# EAGLE design new_york_rev_A (EAGLE 5.11)
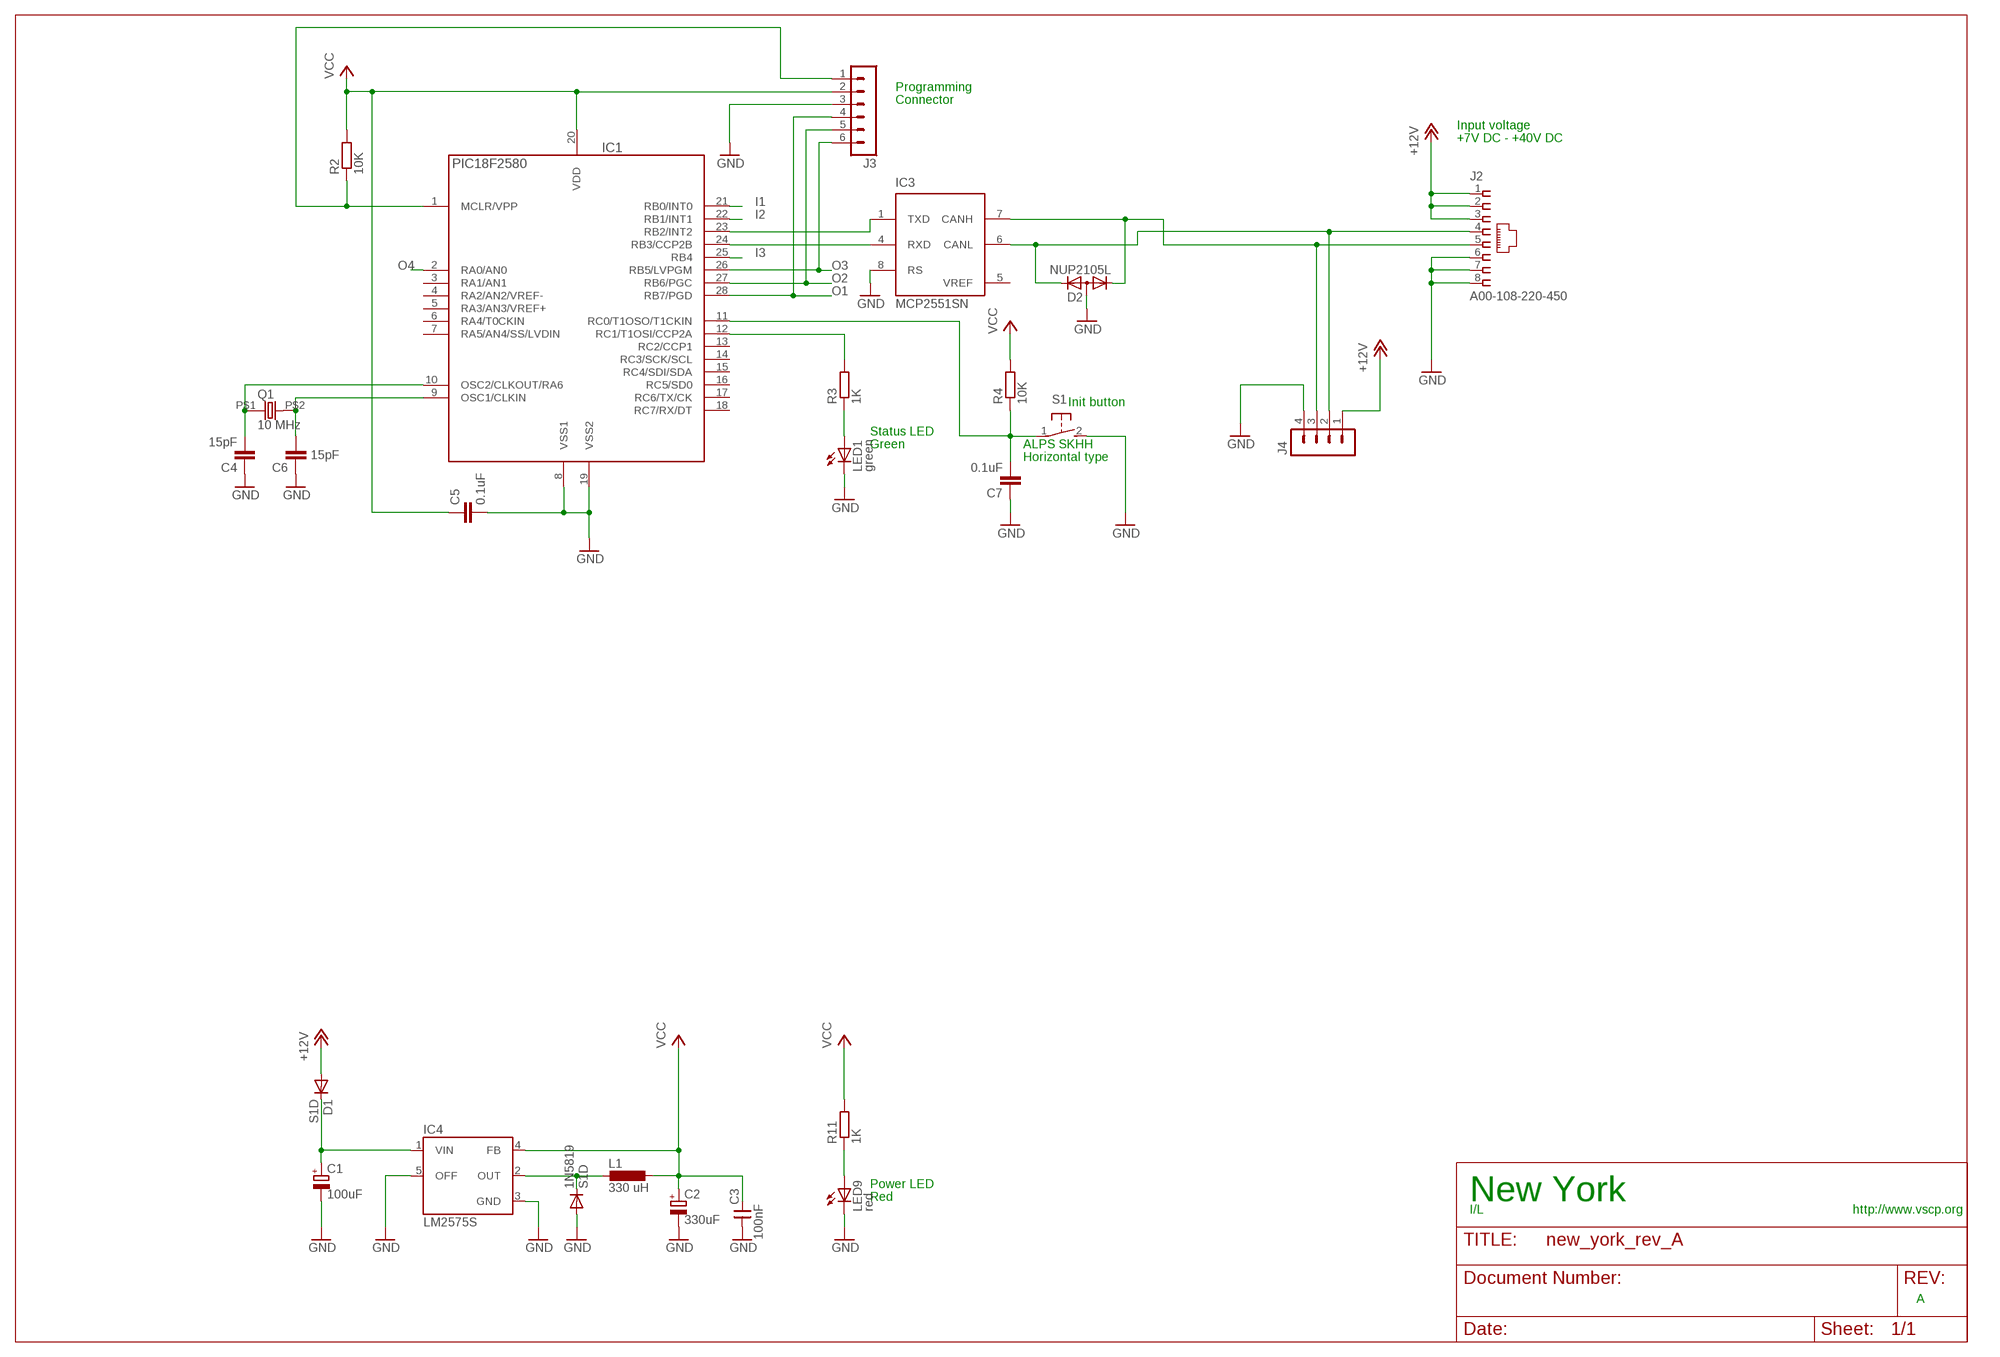
[diagram p0: schematic, sheet 1]

## Parts
1N5819  S1D  DIODE-SMB  [SMB]
C1  100uF  CPOL-EUD  [PANASONIC_D]
C2  330uF  CPOL-EUD  [PANASONIC_D]
C3  100nF  CNP-0805  [0805]
C4  15pF  C-EUC0805  [C0805]
C5  0.1uF  C-EUC0805  [C0805]
C6  15pF  C-EUC0805  [C0805]
C7  0.1uF  C-EUC0805  [C0805]
D1  S1D  DIODE-SMB  [SMB]
D2  NUP2105L  DIODE-2CA|ACSOT23  [SOT23]
IC1  PIC18F2580  PIC18LF252-I/SO  [SO28]
IC3  MCP2551SN  [SO-08]
IC4  LM2575S  [TO263-5]
J2  A00-108-220-450  [RJ-45]
J3  MA06-1  [MA06-1]
J4  MA04-1  [MA04-1]
L1  330 uH  DO3316P  [DO3316P]
LED1  green  LEDCHIP-LED0805  [CHIP-LED0805]
LED9  red  LEDCHIP-LED0805  [CHIP-LED0805]
Q1  10 MHz  HC-49S  [9C]
R2  10K  R-EU_R0805  [R0805]
R3  1K  R-EU_R0805  [R0805]
R4  10K  R-EU_R0805  [R0805]
R11  1K  R-EU_R0805  [R0805]
S1  31-XX  [B3F-31XX]

## Nets
+12V: D1.A J2.1 J2.2 J2.3 J4.1
CANH: D2.1(K1) IC3.7(CANH) J2.5 J4.3
CANL: D2.2(K2) IC3.6(CANL) J2.4 J4.2
GND: 1N5819.A C1.- C2.- C3.1 C4.1 C5.2 C6.1 C7.1 D2.3(A) IC1.8(VSS1) IC1.19(VSS2) IC3.8(RS) IC4.3(GND) IC4.5(OFF) J2.6 J2.7 J2.8 J3.3 J4.4 LED1.C LED9.C S1.2(S)
I1: IC1.21(RB0/INT0)
I2: IC1.22(RB1/INT1)
I3: IC1.25(RB4)
N$1: 1N5819.C IC4.2(OUT) L1.1
N$2: C4.2 IC1.10(OSC2/CLKOUT/RA6) Q1.P$1
N$3: C1.+ D1.C IC4.1(VIN)
N$4: IC1.12(RC1/T1OSI/CCP2A) R3.2
N$5: LED1.A R3.1
N$6: C7.2 IC1.11(RC0/T1OSO/T1CKIN) R4.1 S1.1(P)
N$7: C6.2 IC1.9(OSC1/CLKIN) Q1.P$2
N$12: IC1.1(MCLR/VPP) J3.1 R2.1
N$20: LED9.A R11.1
O1: IC1.28(RB7/PGD) J3.4
O2: IC1.27(RB6/PGC) J3.5
O3: IC1.26(RB5/LVPGM) J3.6
O4: IC1.2(RA0/AN0)
RXCAN: IC1.24(RB3/CCP2B) IC3.4(RXD)
TXCAN: IC1.23(RB2/INT2) IC3.1(TXD)
VCC: C2.+ C3.2 C5.1 IC1.20(VDD) IC4.4(FB) J3.2 L1.2 R2.2 R4.2 R11.2
Unconnected: IC1.3(RA1/AN1) IC1.4(RA2/AN2/VREF-) IC1.5(RA3/AN3/VREF+) IC1.6(RA4/T0CKIN) IC1.7(RA5/AN4/SS/LVDIN) IC1.13(RC2/CCP1) IC1.14(RC3/SCK/SCL) IC1.15(RC4/SDI/SDA) IC1.16(RC5/SD0) IC1.17(RC6/TX/CK) IC1.18(RC7/RX/DT)

## Notes on the sheet
- Programming
- Connector
- Input voltage
- +7V DC - +40V DC
- Init button
- Status LED
- Green | ALPS SKHH
- Horizontal type
- Power LED
- Red | New York
- I/L | http://www.vscp.org
- A

## Power pins joined to a net without a drawn wire
GND: IC3.2(VSS)
VCC: IC3.3(VDD)
VREF: IC3.5(VREF)

## Library data of the parts
1N5819 D1 = diode:DIODE-: DIODE
C1 C2 = rcl:CPOL-EU: POLARIZED CAPACITOR, European symbol
C3 = cap-master:CNP-: NON-POLARIZED CAP
C4-C7 = rcl:C-EU: CAPACITOR, European symbol
D2 = diode:DIODE-2CA|AC: Dual DIODE Cathode-Anode|Anode-Cathode
IC1 = pic_olin:PIC18*F252-?: 18F252, 28 pin, 32Kb prog, 1536 data, 256 EEPROM
IC3 = microchip_can:MCP2551: High Speed CAN tranceiver
IC4 = v-reg-3:LM2575: National Semiconductor <http://www.national.com> 1.0A "Simple Switcher"(c) 52kHz, Vout 1.23-37V (HV: 57V), Vin 40V (HV: 60V), 50µA standby current
J2 = vscpcan:A00-108-220-450
J3 = con-lstb:MA06-1: PIN HEADER; OC_FARNELL: unknown; OC_NEWARK: unknown
J4 = con-lstb:MA04-1: PIN HEADER; OC_FARNELL: unknown; OC_NEWARK: unknown
L1 = inductor-coilcraft:DO3316P: COILCRAFT; OC_FARNELL: unknown; OC_NEWARK: unknown
LED1 LED9 = led:LED: LED OSRAM: - CHIPLED LG R971, LG N971, LY N971, LG Q971, LY Q971, LO R971, LY R971 LH N974, LH R974 LS Q976, LO Q976, LY Q976 LO Q996 - Hyper CHIPLED LW Q18S LB Q993, LB Q99A, LB R99A - SideLED LS A670, LO A670, LY A670, LG A670, LP A670 LB A673, LV A673, LT A673, LW A673 LH A674 LY A675 LS A676, LA A676, LO A676, LY A676, LW A676 LS A679, LY A679, LG A679 - Hyper Micro SIDELED® LS Y876, LA Y876, LO Y876, LY Y876 LT Y87S - SmartLED LW L88C, LW L88S LB L89C, LB L89S, LG L890 LS L89K, LO L89K, LY L89K LS L896, LA L896, LO L896, LY L896 - TOPLED LS T670, LO T670, LY T670, LG T670, LP T670 LSG T670, LSP T670, LSY T670, LOP T670, LYG T670 LG T671, LOG T671, LSG T671 LB T673, LV T673, LT T673, LW T673 LH T674 LS T676, LA T676, LO T676, LY T676, LB T676, LH T676, LSB T676, LW T676 LB T67C, LV T67C, LT T67C, LS T67K, LO T67K, LY T67K, LW E67C LS E67B, LA E67B, LO E67B, LY E67B, LB E67C, LV E67C, LT E67C LW T67C LS T679, LY T679, LG T679 LS T770, LO T770, LY T770, LG T770, LP T770 LB T773, LV T773, LT T773, LW T773 LH T774 LS E675, LA E675, LY E675, LS T675 LS T776, LA T776, LO T776, LY T776, LB T776 LHGB T686 LT T68C, LB T68C - Hyper Mini TOPLED® LB M676 - Mini TOPLED Santana® LG M470 LS M47K, LO M47K, LY M47K Source: http://www.osram.convergy.de LUXEON: - LUMILED® LXK2-PW12-R00, LXK2-PW12-S00, LXK2-PW14-U00, LXK2-PW14-V00 LXK2-PM12-R00, LXK2-PM12-S00, LXK2-PM14-U00 LXK2-PE12-Q00, LXK2-PE12-R00, LXK2-PE12-S00, LXK2-PE14-T00, LXK2-PE14-U00 LXK2-PB12-K00, LXK2-PB12-L00, LXK2-PB12-M00, LXK2-PB14-N00, LXK2-PB14-P00, LXK2-PB14-Q00 LXK2-PR12-L00, LXK2-PR12-M00, LXK2-PR14-Q00, LXK2-PR14-R00 LXK2-PD12-Q00, LXK2-PD12-R00, LXK2-PD12-S00 LXK2-PH12-R00, LXK2-PH12-S00 LXK2-PL12-P00, LXK2-PL12-Q00, LXK2-PL12-R00 Source: www.luxeon.com KINGBRIGHT: KA-3528ASYC Source: www.kingbright.com
Q1 = vscpcan:HC-49S: Digikey 887-1050-1-nd
R2-R4 R11 = rcl:R-EU_: RESISTOR, European symbol
S1 = switch-omron:31-XX: OMRON SWITCH; MPN: B3F-3100; OC_FARNELL: 959704; OC_NEWARK: 36M3582

## Board
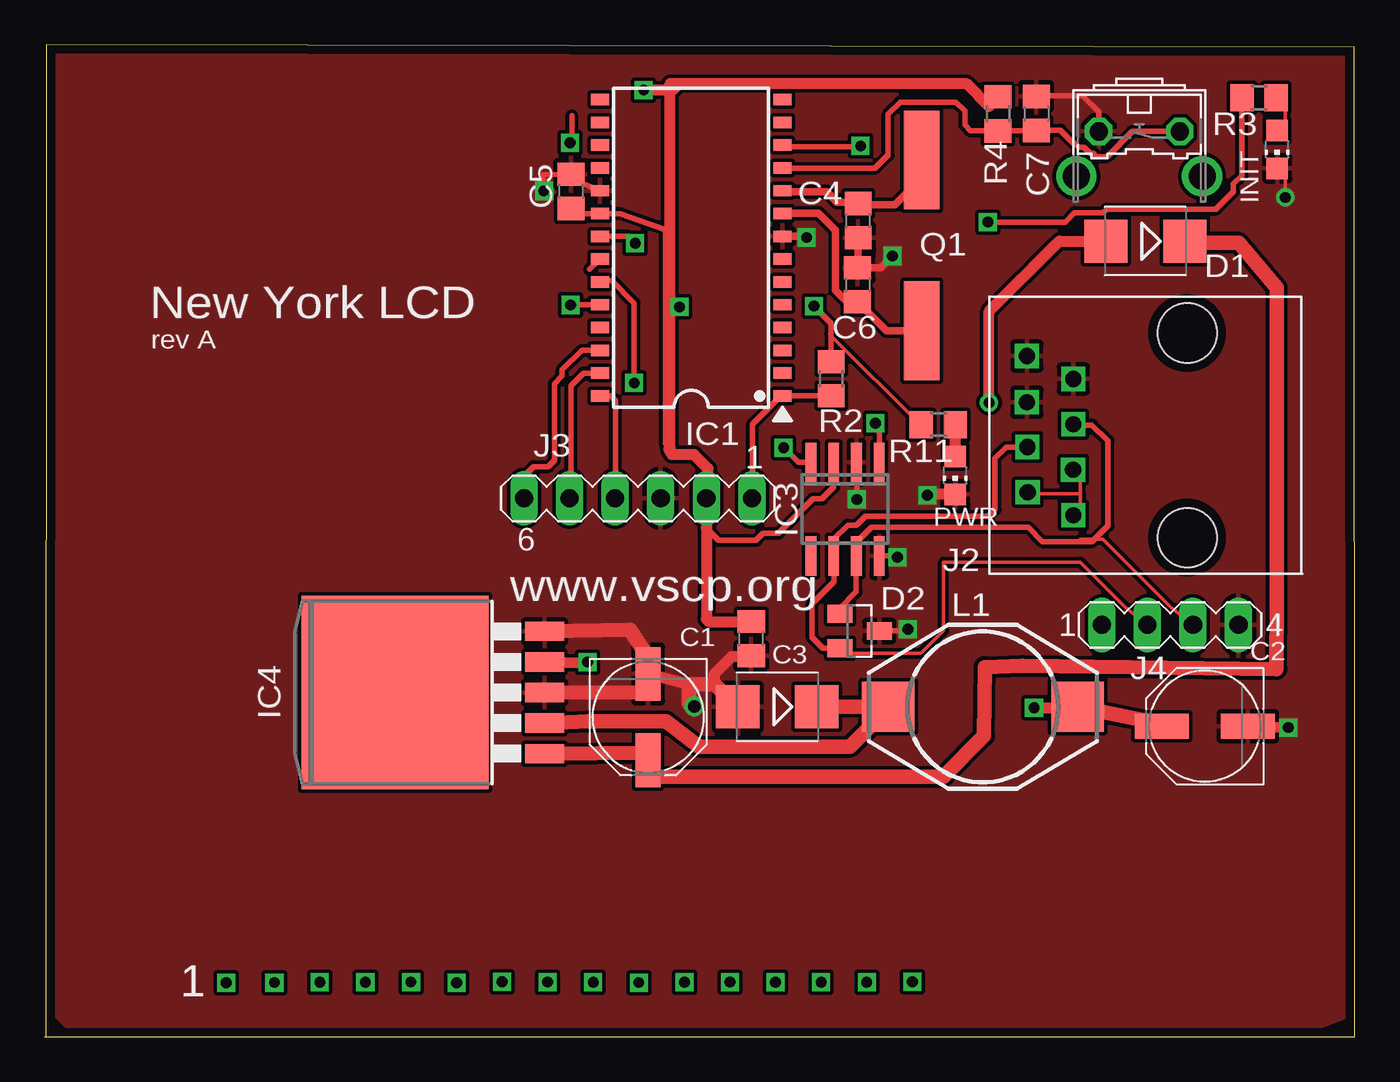
[diagram p1: board, top side]
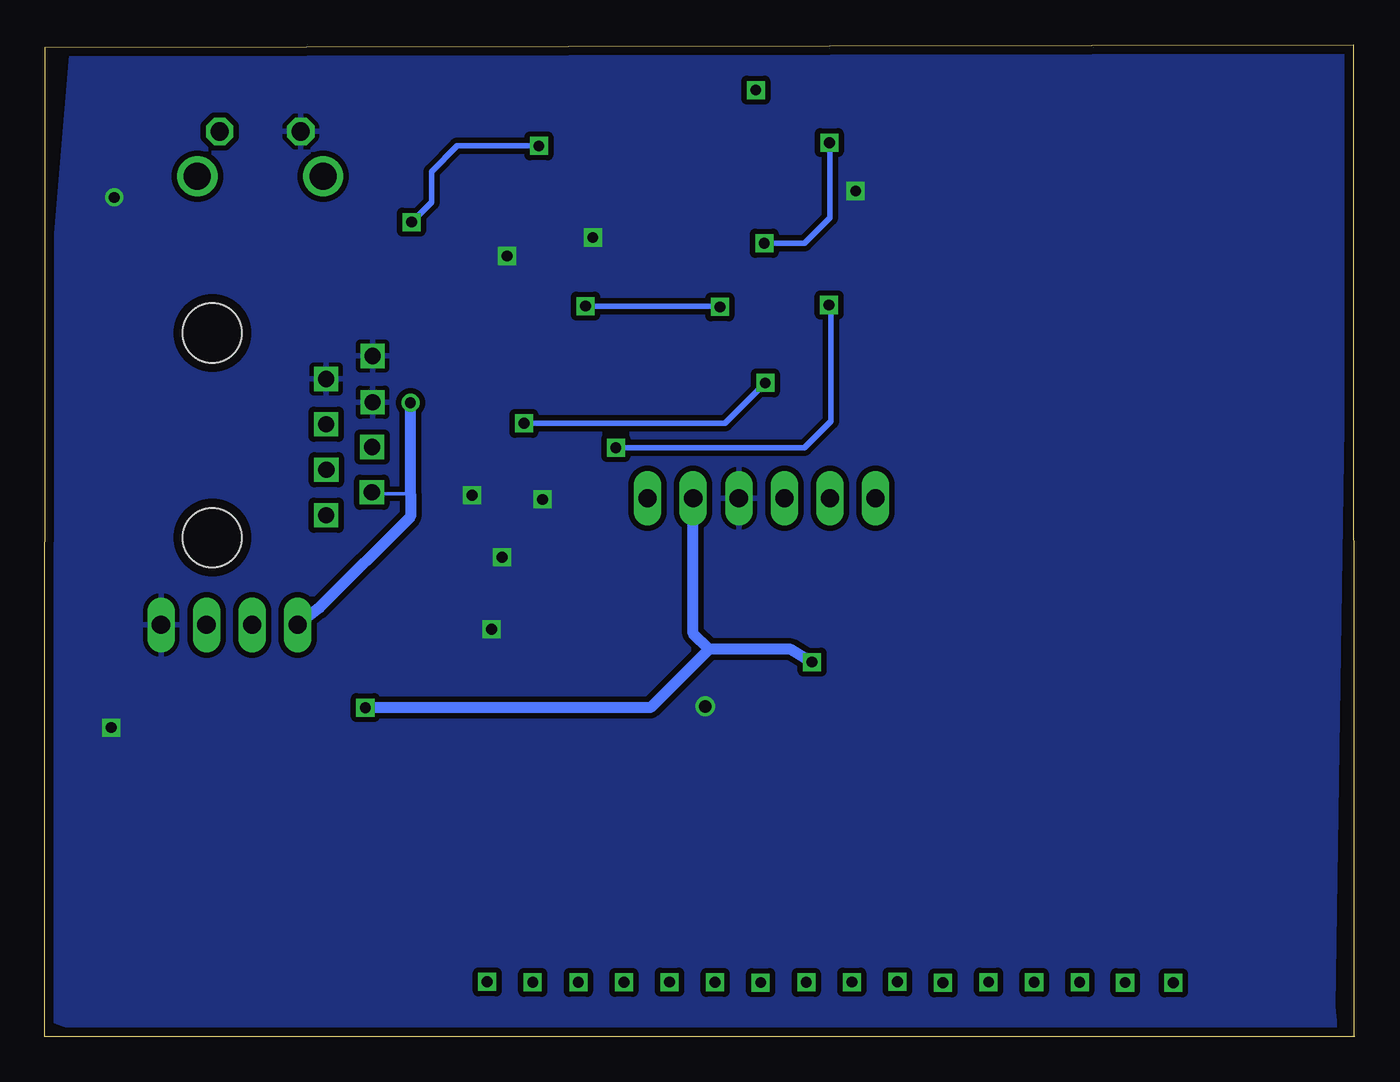
[diagram p2: board, bottom side, seen from below]

Size 72.99 x 55.25 mm. Coordinates in mm from the lower left corner, seen from the top.
Outline: 0,0 72.99,0 72.98,55.13 0.08,55.25 0.04,0.01
Copper layers (1*16): Top 0.035mm / dielectric 1.5mm / Bottom 0.035mm
Design rules "8mils": minimum track width 8mil, minimum drill 0.6mm, track to track 8mil, track to pad 8mil, pad to pad 8mil, via to via 8mil, smd to smd 0mil, copper to edge 20mil, drill to drill 10mil, minimum pad ring 8mil, minimum via ring 8mil, stop-mask expansion 0mil, vias tented up to drill 0mil, thermal gap 10mil

### Footprints (pad centres in the part's own frame; a part is rotated, then mirrored left to right if it is on the bottom)
SMB = smd 2.4 x 2.4: A 2.2,0; C -2.2,0
PANASONIC_D = smd 3 x 1.4: + 2.4,0; - -2.4,0
0805 = smd 1.27 x 1.524: 1 -0.953,0; 2 0.953,0
C0805 = smd 1.3 x 1.5: 1 -0.95,0; 2 0.95,0
SOT23 = smd 1 x 1.4: 1 -0.95,-1.1; 2 0.95,-1.1; 3 0,1.1
SO28 = smd 0.635 x 1.016: 1 -8.255,-5.08; 2 -6.985,-5.08; 3 -5.715,-5.08; 4 -4.445,-5.08; 5 -3.175,-5.08; 6 -1.905,-5.08; 7 -0.635,-5.08; 8 0.635,-5.08; 9 1.905,-5.08; 10 3.175,-5.08; 11 4.445,-5.08; 12 5.715,-5.08; 13 6.985,-5.08; 14 8.255,-5.08; 15 8.255,5.08; 16 6.985,5.08; 17 5.715,5.08; 18 4.445,5.08; 19 3.175,5.08; 20 1.905,5.08; 21 0.635,5.08; 22 -0.635,5.08; 23 -1.905,5.08; 24 -3.175,5.08; 25 -4.445,5.08; 26 -5.715,5.08; 27 -6.985,5.08; 28 -8.255,5.08
SO-08 = smd 0.6 x 2.2: 1 -1.905,-2.6; 2 -0.635,-2.6; 3 0.635,-2.6; 4 1.905,-2.6; 5 1.905,2.6; 6 0.635,2.6; 7 -0.635,2.6; 8 -1.905,2.6
TO263-5 = smd 1.067 x 2.159: 1 -3.404,-5.791; 2 -1.702,-5.791; 3 0,-5.791; 4 1.702,-5.791; 5 3.404,-5.791 | smd 10.8 x 10.41: 6 0,2.54
RJ-45 = drill 0.9 square: 1 -4.45,6.35; 2 -3.17,8.89; 3 -1.92,6.36; 4 -0.65,8.91; 5 0.62,6.35; 6 1.84,8.93; 7 3.14,6.35; 8 4.42,8.93 | hole 3.3: -5.7,0; 5.7,0
MA06-1 = drill 1.016 long: 1 -6.35,0; 2 -3.81,0; 3 -1.27,0; 4 1.27,0; 5 3.81,0; 6 6.35,0
MA04-1 = drill 1.016 long: 1 -3.81,0; 2 -1.27,0; 3 1.27,0; 4 3.81,0
DO3316P = smd 2.92 x 2.79: 1 -5.28,0; 2 5.28,0
CHIP-LED0805 = smd 1.2 x 1.2: A 0,-1.05; C 0,1.05
9C = smd 5.5 x 2: P$1 -4.74,0; P$2 4.76,0
R0805 = smd 1.3 x 1.5: 1 -0.95,0; 2 0.95,0
B3F-31XX = drill 1.016 octagon: 1 -2.261,-1.245; 2 2.261,-1.245 | drill 1.499 pad 2.159 round: 3 -3.505,1.245; 4 3.505,1.245

### Placement (x,y rotation side)
1N5819  40.81,18.37 180 top
C1  33.62,17.8 270 top
C2  64.64,17.3 180 top
C3  39.36,22.17 90 top
C4  45.32,45.46 90 top
C5  29.33,47.09 90 top
C6  45.29,41.89 270 top
C7  55.25,51.43 270 top
D1  61.32,44.32 180 top
D2  45.4,22.6 270 top
IC1  36.02,43.95 90 top
IC3  44.59,29.39 180 top
IC4  22.05,19.17 90 top
J2  63.66,33.5 90 top
J3  33.05,29.99 180 top
J4  62.71,22.94 0 top
L1  52.27,18.37 0 top
LED1  68.67,49.42 180 top
LED9  50.73,31.26 180 top
Q1  48.86,44.09 270 top
R2  43.82,36.65 90 top
R3  67.66,52.31 180 top
R4  53.12,51.41 90 top
R11  49.79,34.1 180 top
S1  60.99,49.18 180 top

### Tracks (layer width: path | path; a pad name or v marks a point on that pad's centre or on a via)
+12V  (via drill 0.6)
  Top 0.203: 57.7,30.24 55.16,30.24 J2.2 | 57.7,30.24 57.7,31.51 J2.3 | 57.7,30.24 57.7,28.97 J2.1 | 56.43,44.21 56.54,44.32
  Top 0.406: 59.1,44.3 D1.A
  Top 0.61: 55.05,42.86 56.23,44.04 56.54,44.32 59.1,44.3 | 56.43,44.21 52.62,40.4 v52.62,35.32
  Bottom 0.203: 52.62,30.24 55.16,30.24 J2.2
  Bottom 0.61: v52.62,35.32 52.62,30.24 52.62,28.97 57.7,23.89 J4.1
CANH
  Top 0.203: J4.3 62.78,23.89 58.97,27.7 57.7,27.7 57.7,27.58
  Top 0.305: D2.1 44.3,23.88 45.2,24.78 45.2,26.77 IC3.7 45.23,27.55 46.05,28.37 54.8,28.37 55.59,27.58 57.7,27.58 58.36,27.58 59.24,28.46 59.24,33.19 58.36,34.07 57.36,34.07 J2.5
CANL
  Top 0.203: J4.2 60.24,23.89 57.7,26.43 50.08,26.43 50.08,22.62 48.81,21.35 43.73,21.35 D2.2
  Top 0.305: D2.2 43.35,21.65 42.76,22.24 42.76,24.13 43.96,25.33 IC3.6 43.95,27.71 44.74,28.5 45.24,28.5 45.72,28.98 52.55,28.98 52.95,29.38 52.95,32.21 53.57,32.83 54.73,32.83 J2.4
GND  (via drill 0.6, 0.7)
  Top 0.203: v69.13,46.75 69.13,48.02 LED1.C
  Top 0.254: 35.91,19.64 35.91,19.82
  Top 0.305: D2.3 48,22.6 v48.09,22.69 | IC3.8 47.42,26.79 v47.51,26.7 | v45.26,29.93 45.26,31.96 IC3.2 | S1.2 58.73,51.52 57.83,52.42 55.29,52.42 C7.1 | IC1.19 29.36,47.77 C5.2 27.77,48.01 v27.81,47.11
  Top 0.406: 45.25,44.58 C4.1 45.32,42.87 C6.1 46.59,42.84 v47.24,43.49 | IC1.8 42.38,44.58 v42.45,44.52
  Top 0.61: 33.93,19.18 33.61,19.11 33.9,19.67 33.93,19.64 | 33.93,19.64 33.98,19.59 | 33.93,19.64 C1.- | 38.7,18.25 38.61,18.34 1N5819.A 38.75,18.37 | C1.- 35.91,19.64 | 38.75,18.37 38.86,18.27 | 38.75,18.37 38.21,18.92 | 33.72,19.61 33.62,19.52 | C1.- 33.72,19.61 | 33.75,20.91 33.75,19.64 33.72,19.61 | 35.91,18.55 v36.19,18.4 | C2.- 69.41,17.24 | 37.3,19.64 37.3,20.21 38.29,21.19 39.33,21.19 C3.1 | LED9.C 49.23,30.21 v49.18,30.16
  Top 0.813: IC4.3 33.93,19.18 | 38.61,18.34 37.3,19.64 35.91,19.64 35.91,18.55 | IC4.5 32.62,22.67 33.75,20.91 | 69.41,17.24 v69.29,17.22
  pour Bottom (isolate 0.305): 1.22,1.63 1.12,0.59 71.66,0.62 73.46,1.28 73.18,34.45 71.44,55.34 0.05,55.24 0.73,34.03
  pour Top: 0.48,55.04 0.64,1.16 1.19,0.61 71.2,0.61 72.4,1.08 72.63,41.41 72.63,54.8 38.27,54.8 37.55,54.96
I1  (via drill 0.6)
  Top 0.305: IC1.21 32.52,44.58 v32.9,44.2 | v29.27,49.8 29.27,49.74 29.37,49.64 29.37,51.3
  Bottom 0.305: v32.9,44.2 30.66,44.2 29.24,45.62 29.24,49.77 v29.27,49.8
I2
  Top 0.305: 30.36,42.74 IC1.22
N$1
  Top 0.61: 47.11,18.32 47.06,18.37 L1.1 46.99,18.27 | IC4.2 27.93,17.41 27.81,17.36
  Top 0.813: L1.1 1N5819.C | 46.99,18.27 44.88,16.16 36.44,16.16 34.63,17.57 30.3,17.56 27.89,17.46 27.93,17.41
N$2
  Top 0.406: Q1.P$1 48.86,47.83 47.38,46.35 44.94,46.35 44.8,46.49 | 44.8,46.49 45.24,46.49 C4.2 | 44.8,46.49 44.15,46.49 43.58,47.06 41.16,47.06 IC1.10
N$3
  Top 0.406: 33.63,15.82 C1.+ 34.07,14.49 | D1.C 63.76,44.32 63.86,44.22
  Top 0.813: IC4.1 33.63,15.82 | 63.86,44.22 66.53,44.22 68.64,41.73 68.64,24.32 68.63,20.48 54.47,20.65 52.38,20.58 52.34,16.76 50.07,14.49 34.07,14.49
N$4  (via drill 0.6)
  Top 0.305: IC1.12 41.2,49.66 41.29,49.58 45.42,49.58 v45.46,49.62 | v52.56,45.38 56.86,45.38 57.38,45.9 58.97,45.9 59.17,46.1 65.26,46.1 66.24,47.08 66.24,47.5 66.71,47.97 R3.2
  Bottom 0.305: v45.46,49.62 50.01,49.62 51.45,48.18 51.45,46.49 v52.56,45.38
N$5
  Top 0.203: 69.13,51.83 69.13,50.56 LED1.A
  Top 0.254: 69.13,51.83 R3.1
N$6
  Top 0.305: IC1.11 41.11,48.38 46.27,48.38 46.99,49.1 46.99,51.38 47.67,52.06 50.77,52.06 51.26,51.57 51.26,50.79 51.59,50.46 R4.1 55.23,50.46 C7.2 55.27,50.5 56.6,50.5 57.35,49.75 57.41,49.75 57.61,49.55 57.9,49.55 58.23,49.22 58.42,49.22 58.61,49.03 59.2,49.03 60.59,50.42 S1.1
N$7
  Top 0.406: Q1.P$2 46.9,39.33 C6.2 44.69,40.94 44.06,41.57 44.06,44.91 43.11,45.86 IC1.9
N$8  (via drill 0.6)
  other vias: 10.1,3
N$9  (via drill 0.6)
  other vias: 12.79,3.01
N$10  (via drill 0.6)
  other vias: 15.32,3.03
N$11  (via drill 0.6)
  other vias: 17.86,3.03
N$12
  Top 0.305: IC1.1 R2.1 41.02,35.7 39.44,34.12 39.44,30.03 J3.1
N$13  (via drill 0.6)
  other vias: 20.4,3.04
N$14  (via drill 0.6)
  other vias: 22.94,3
N$15  (via drill 0.6)
  other vias: 25.48,3.05
N$16  (via drill 0.6)
  other vias: 28.02,3.04
N$17  (via drill 0.6)
  other vias: 30.56,3.03
N$18  (via drill 0.6)
  other vias: 33.1,3.01
N$19  (via drill 0.6)
  other vias: 35.64,3.03
N$20
  Top 0.61: R11.1 LED9.A
N$21  (via drill 0.6)
  other vias: 38.18,3.04
N$22  (via drill 0.6)
  other vias: 40.72,3.03
N$23  (via drill 0.6)
  other vias: 43.26,3.03
N$24  (via drill 0.6)
  other vias: 45.8,3.03
N$25  (via drill 0.6)
  other vias: 48.34,3.05
O1
  Top 0.305: IC1.28 31.52,35.7 31.8,35.42 31.8,30.01 J3.4
O2
  Top 0.305: IC1.27 30.01,36.96 29.31,36.26 29.31,30.06 J3.5
O3
  Top 0.305: IC1.26 29.92,38.23 28.83,37.14 28.83,36.81 28.4,36.38 28.4,32.11 28.05,31.76 27.24,31.76 26.7,31.22 J3.6
RXCAN  (via drill 0.6)
  Top 0.305: IC3.4 41.99,31.99 v41.17,32.81 | v29.29,40.76 30.92,40.76 IC1.24
  Bottom 0.305: v41.17,32.81 30.65,32.81 29.18,34.28 29.18,40.65 v29.29,40.76
TXCAN  (via drill 0.6)
  Top 0.305: IC3.1 46.49,33.96 v46.29,34.17 | v32.84,36.42 32.84,40.87 31.6,42.11 31,42.11 IC1.23
  Bottom 0.305: v46.29,34.17 35.09,34.17 v32.84,36.42
VCC  (via drill 0.6)
  Top 0.203: R11.2 48.81,34.05 43.73,39.13 43.82,39.13
  Top 0.254: 34.76,32.73 34.84,32.78
  Top 0.305: 34.58,40.54 34.58,33.04 34.76,32.73 | 34.58,40.54 34.58,44.94 32.05,45.85 IC1.20 30.04,45.85 C5.1 | J3.2 36.96,30.09 | 30.14,20.82 v30.24,20.87 | IC3.3 43.95,30.61 43.31,29.96 42.79,29.96 40.87,28.04 40.02,28.04 39.63,27.65 37.54,27.65 36.86,28.33 | 57.5,18.33 L1.2 | R2.2 43.82,39.13 43.82,39.74 v42.86,40.7 | v35.37,40.65 34.69,40.65 34.58,40.54
  Top 0.406: 62.33,17.41 C2.+
  Top 0.61: 34.76,32.73 34.94,32.42 36.18,32.42 36.96,31.64 36.96,30.09 | IC4.4 30.14,20.82 | C3.2 37,23.12 36.86,23.26 36.86,28.33 J3.2 | v55.13,18.33 57.5,18.33 | 35.36,53.1 34.84,53.1 34.84,32.78 | 35.36,53.1 51.35,53.1 52.62,51.83 R4.2 | v33.37,52.73 34.99,52.73 35.36,53.1
  Top 0.813: L1.2 62.33,17.41
  Bottom 0.305: v42.86,40.7 35.42,40.7 v35.37,40.65
  Bottom 0.61: J3.2 36.86,22.45 35.99,21.58 | 35.99,21.58 31.42,21.58 v30.24,20.87 | v55.13,18.33 39.24,18.33 35.99,21.58 | v33.37,52.73 33.32,52.78

### Text on the board
tNames: INIT | New York LCD | rev A | PWR | www.vscp.org | 1